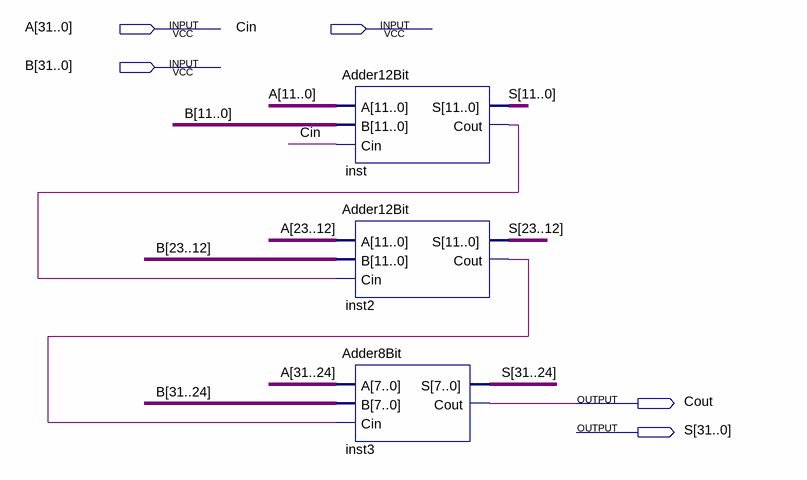
[diagram p0: schematic sheet]
// Quartus schematic Adder32BIt.bdf as structural Verilog: 3 symbols, 5 pins
module Adder32BIt (
  input  [31:0] A,
  input  Cin,
  input  [31:0] B,
  output Cout,
  output [31:0] S
);

  wire inst2_cout, inst_cout;

  Adder12Bit inst (.A(A[11:0]), .B(B[11:0]), .Cin(Cin), .S(S[11:0]), .Cout(inst_cout));
  Adder12Bit inst2 (.A(A[23:12]), .B(B[23:12]), .Cin(inst_cout), .S(S[23:12]), .Cout(inst2_cout));
  Adder8Bit inst3 (.A(A[31:24]), .B(B[31:24]), .Cin(inst2_cout), .S(S[31:24]), .Cout(Cout));
endmodule
